# EAGLE schematic transistors (EAGLE 6.4)
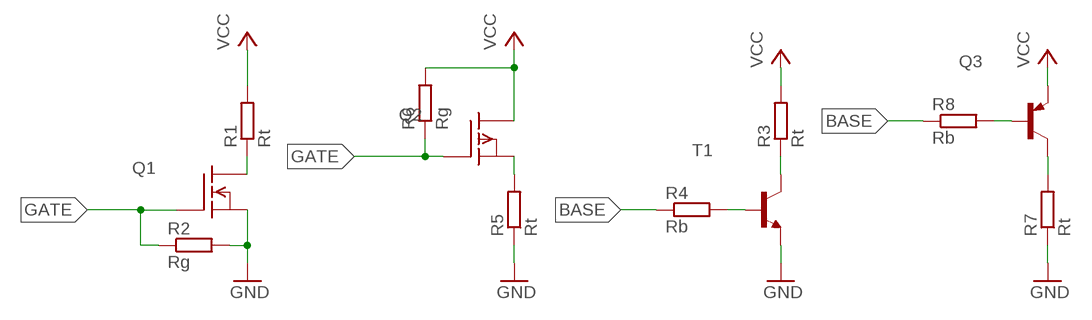
[diagram p0: schematic, sheet 1]

## Parts
Q1  BSS97  [TO202]
Q2  BSS92  [TO92]
Q3  2N3576  [TO18]
R1  Rt  R-EU_0207/15  [0207/15]
R2  Rg  R-EU_0207/15  [0207/15]
R3  Rt  R-EU_0207/15  [0207/15]
R4  Rb  R-EU_0207/15  [0207/15]
R5  Rt  R-EU_0207/15  [0207/15]
R6  Rg  R-EU_0207/15  [0207/15]
R7  Rt  R-EU_0207/15  [0207/15]
R8  Rb  R-EU_0207/15  [0207/15]
T1  2N2219  [TO5]

## Nets
BASE: R4.1 R8.1
GATE: Q1.3(G) Q2.1(G) R2.1 R6.1
GND: Q1.1(S) R2.2 R5.1 R7.1 T1.1(E)
N$1: Q1.2(D) R1.1
N$3: R3.1 T1.3(C)
N$4: R4.2 T1.2(B)
N$6: Q2.3(S) R5.2
N$9: Q3.3(C) R7.2
N$10: Q3.2(B) R8.2
VCC: Q2.2(D) Q3.1(E) R1.2 R3.2 R6.2

## Library data of the parts
Q1 = transistor-fet:BSS97: N-Channel Enhancement MOSFET 200V; 1.5A; 1,6Ohm
Q2 = transistor-fet:BSS92: P-Channel Enhancement MOSFET -200V; -0,15A; 11Ohm
Q3 = transistor-pnp:2N3576: PNP Transistor
R1-R8 = rcl:R-EU_: RESISTOR, European symbol
T1 = transistor:2N2219: NPN TRANSISTOR